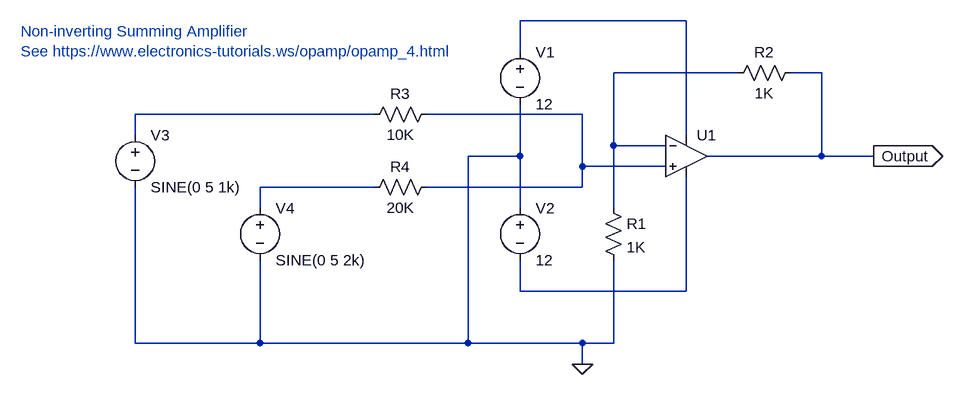
[diagram p0: schematic invsumopamp.asc]
invsumopamp.asc, the LTspice schematic file:
Version 4
SHEET 1 880 680
WIRE 352 -32 96 -32
WIRE 96 16 96 -32
WIRE 432 48 240 48
WIRE 560 48 512 48
WIRE -128 112 -496 112
WIRE 192 112 -48 112
WIRE -496 144 -496 112
WIRE 352 144 352 -32
WIRE 240 160 240 48
WIRE 320 160 240 160
WIRE 96 176 96 96
WIRE 96 176 16 176
WIRE 560 176 560 48
WIRE 560 176 384 176
WIRE 640 176 560 176
WIRE 192 192 192 112
WIRE 320 192 192 192
WIRE -128 224 -304 224
WIRE 192 224 192 192
WIRE 192 224 -48 224
WIRE -304 256 -304 224
WIRE 96 256 96 176
WIRE 240 256 240 160
WIRE 96 384 96 336
WIRE 352 384 352 208
WIRE 352 384 96 384
WIRE -496 464 -496 224
WIRE -304 464 -304 336
WIRE -304 464 -496 464
WIRE 16 464 16 176
WIRE 16 464 -304 464
WIRE 192 464 16 464
WIRE 240 464 240 336
WIRE 240 464 192 464
WIRE 192 496 192 464
FLAG 640 176 Output
IOPIN 640 176 Out
FLAG 192 496 0
SYMBOL OpAmps\\UniversalOpAmp 352 176 R0
SYMATTR InstName U1
SYMBOL voltage 96 0 R0
WINDOW 123 0 0 Left 0
WINDOW 39 0 0 Left 0
SYMATTR InstName V1
SYMATTR Value 12
SYMBOL voltage 96 240 R0
WINDOW 123 0 0 Left 0
WINDOW 39 0 0 Left 0
SYMATTR InstName V2
SYMATTR Value 12
SYMBOL res 224 240 R0
SYMATTR InstName R1
SYMATTR Value 1K
SYMATTR SpiceLine tol=1 pwr=0.1
SYMBOL res 528 32 R90
WINDOW 0 0 56 VBottom 2
WINDOW 3 32 56 VTop 2
SYMATTR InstName R2
SYMATTR Value 1K
SYMATTR SpiceLine tol=1 pwr=0.1
SYMBOL res -32 96 R90
WINDOW 0 0 56 VBottom 2
WINDOW 3 32 56 VTop 2
SYMATTR InstName R3
SYMATTR Value 10K
SYMATTR SpiceLine tol=1 pwr=0.1
SYMBOL res -32 208 R90
WINDOW 0 0 56 VBottom 2
WINDOW 3 32 56 VTop 2
SYMATTR InstName R4
SYMATTR Value 20K
SYMATTR SpiceLine tol=1 pwr=0.1
SYMBOL voltage -496 128 R0
WINDOW 123 0 0 Left 0
WINDOW 39 0 0 Left 0
SYMATTR InstName V3
SYMATTR Value SINE(0 5 1k)
SYMBOL voltage -304 240 R0
WINDOW 123 0 0 Left 0
WINDOW 39 0 0 Left 0
SYMATTR InstName V4
SYMATTR Value SINE(0 5 2k)
TEXT -672 -16 Left 2 ;Non-inverting Summing Amplifier\nSee https://www.electronics-tutorials.ws/opamp/opamp_4.html

The netlist it stands for:
* invsumopamp.asc
XU1 N004 N002 N001 N006 Output level1 Avol=1Meg GBW=10Meg Vos=0 En=0 Enk=0 In=0 Ink=0 Rin=500Meg  ; pins In+ In- V+ V- OUT
V1 N001 0 12
V2 0 N006 12
R1 N002 0 1K tol=1 pwr=0.1
R2 Output N002 1K tol=1 pwr=0.1
R3 N004 N003 10K tol=1 pwr=0.1
R4 N004 N005 20K tol=1 pwr=0.1
V3 N003 0 SINE(0 5 1k)
V4 N005 0 SINE(0 5 2k)
* Non-inverting Summing Amplifier
* See https://www.electronics-tutorials.ws/opamp/opamp_4.html
.lib UniversalOpAmp1.lib
.backanno
.end